# EAGLE design 1-WirePlug (EAGLE 6.5.0)
ABBREV: hb1; PROJECT: Heading Board
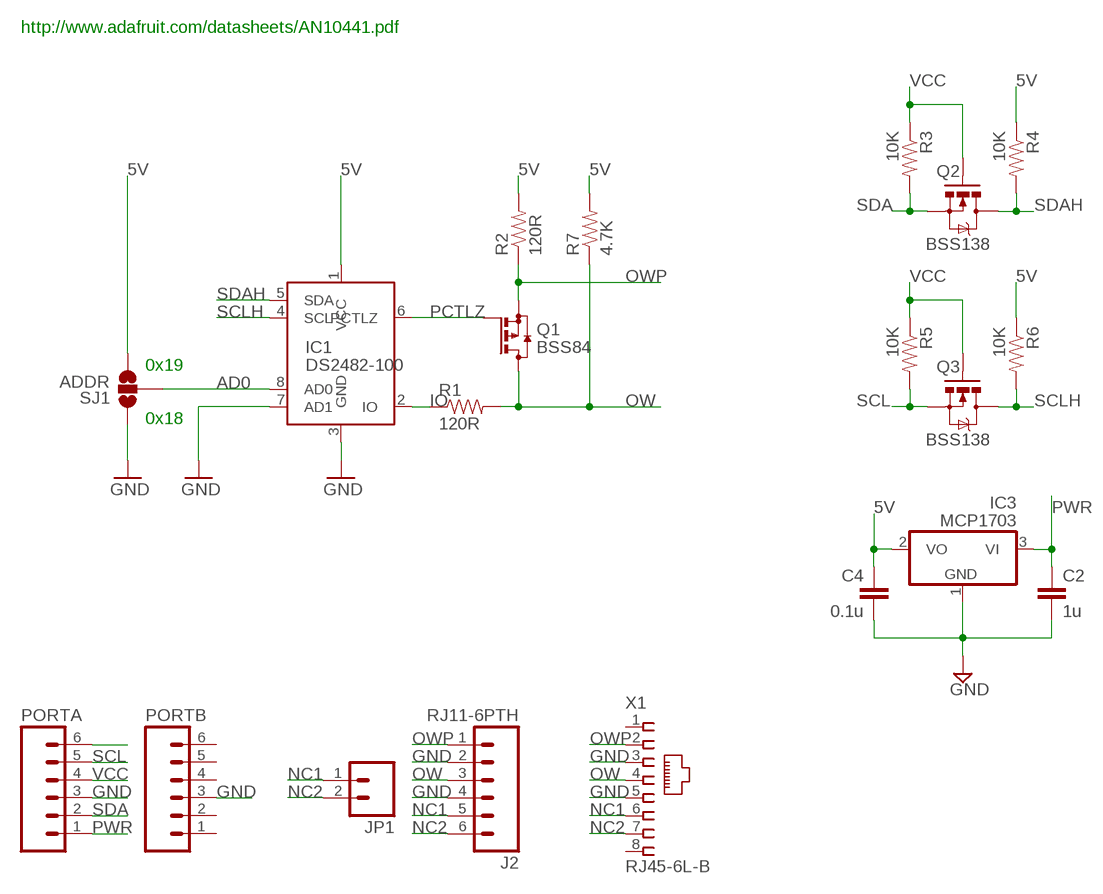
[diagram p0: schematic, sheet 1]

## Parts
C2  1u  CAP0603-CAP  [0603-CAP]
C4  0.1u  CAP0603-CAP  [0603-CAP]
IC1  DS2482-100  [SO08]
IC3  MCP1703  MCP1703CB  [SOT23]
J2  RJ11-6PTH  [RJ11-6]
JP1  M02PTH  [1X02]
PORTA  M06SIP_LOCK  [1X06-SIP_LOCK]
PORTB  M06SIP_LOCK  [1X06-SIP_LOCK]
Q1  BSS84  [SOT23]
Q2  BSS138  MOSFET-NCHANNELSMD  [SOT23-3]
Q3  BSS138  MOSFET-NCHANNELSMD  [SOT23-3]
R1  120R  RESISTOR0603-RES  [0603-RES]
R2  120R  RESISTOR0603-RES  [0603-RES]
R3  10K  RESISTOR0603-RES  [0603-RES]
R4  10K  RESISTOR0603-RES  [0603-RES]
R5  10K  RESISTOR0603-RES  [0603-RES]
R6  10K  RESISTOR0603-RES  [0603-RES]
R7  4.7K  RESISTOR0603-RES  [0603-RES]
SJ1  ADDR  SOLDERJUMPER_2WAYPASTE1&2  [SJ_3_PASTE1&2]
X1  RJ45-6L-B  [RJ45-NO-SHIELD]

## Nets
5V: C4.1 IC1.1(VCC) IC3.2(VO) R2.2 R4.1 R6.1 R7.2 SJ1.3
AD0: IC1.8(AD0) SJ1.2
GND: C2.2 C4.2 IC1.3(GND) IC1.7(AD1) IC3.1(GND) J2.2 J2.4 PORTA.3 PORTB.3 SJ1.1 X1.3 X1.5
IO: IC1.2(IO) R1.1
N$1: PORTA.6
NC1: J2.5 JP1.1 X1.6
NC2: J2.6 JP1.2 X1.7
OW: J2.3 Q1.3(D) R1.2 R7.1 X1.4
OWP: J2.1 Q1.2(S) R2.1 X1.2
PCTLZ: IC1.6(PCTLZ) Q1.1(G)
PWR: C2.1 IC3.3(VI) PORTA.1
SCL: PORTA.5 Q3.2(S) R5.2
SCLH: IC1.4(SCL) Q3.3(D) R6.2
SDA: PORTA.2 Q2.2(S) R3.2
SDAH: IC1.5(SDA) Q2.3(D) R4.2
VCC: PORTA.4 Q2.1(G) Q3.1(G) R3.1 R5.1
Unconnected: PORTB.1 PORTB.2 PORTB.4 PORTB.5 PORTB.6 X1.1 X1.8

## Notes on the sheet
- http://www.adafruit.com/datasheets/AN10441.pdf
- 0x19
- 0x18

## Library data of the parts
C2 C4 = SparkFun:CAP: Capacitor Standard 0603 ceramic capacitor, and 0.1" leaded capacitor.
IC1 = icontroller:DS2482-100: Single-Channel 1-Wire Master
IC3 = linear:MCP1703: 250 mA, 16V, Low Quiescent Current LDO Regulator Source: http://ww1.microchip.com/downloads/en/DeviceDoc/22049b.pdf
J2 = SparkFun:RJ11-6: RJ11 Jack Simple 6 pin RJ11 jack. Commonly found on CAT3 devices and Microchip programmers. SKU: PRT-00132
JP1 = SparkFun:M02: Header 2 Standard 2-pin 0.1" header. Use with straight break away headers (SKU : PRT-00116), right angle break away headers (PRT-00553), swiss pins (PRT-00743), machine pins (PRT-00117), and female headers (PRT-00115). Molex polarized connector foot print use with SKU : PRT-08233 with associated crimp pins and housings.
PORTA PORTB = SparkFun-Connectors:M06: Header 6 Standard 6-pin 0.1" header. Use with straight break away headers (SKU : PRT-00116), right angle break away headers (PRT-00553), swiss pins (PRT-00743), machine pins (PRT-00117), and female headers (PRT-00115). Molex polarized connector foot print use with SKU : PRT-08094 with associated crimp pins and housings. NOTES ON THE VARIANTS LOCK and LOCK_LONGPADS... This footprint was designed to help hold the alignment of a through-hole component (i.e. 6-pin header) while soldering it into place. You may notice that each hole has been shifted either up or down by 0.005 of an inch from it's more standard position (which is a perfectly straight line). This slight alteration caused the pins (the squares in the middle) to touch the edges of the holes. Because they are alternating, it causes a "brace" to hold the component in place. 0.005 has proven to be the perfect amount of "off-center" position when using our standard breakaway headers. Although looks a little odd when you look at the bare footprint, once you have a header in there, the alteration is very hard to notice. Also,if you push a header all the way into place, it is covered up entirely on the bottom side. This idea of altering the position of holes to aid alignment will be further integrated into the Sparkfun Library for other footprints. It can help hold any component with 3 or more connection pins.
Q1 = transistor-small-signal:BSS84: P-CHANNEL MOS FET
Q2 Q3 = SparkFun:MOSFET-NCHANNEL
R1-R7 = SparkFun:RESISTOR: Resistor Basic schematic elements and footprints for 0603, 1206, and PTH resistors.
SJ1 = SparkFun:SOLDERJUMPER_2WAY: Solder Jumper 2 way solder jumper
X1 = con-tycoelectronics:RJ45: CORCOM Modular RJ Jacks No Shield Source: www.tycoelectronics.com .. ENG_DS_1654001_1099_RJ_L_0507.pdf; MPN: RJ45-6L-B; OC_FARNELL: unknown; OC_NEWARK: 16R6090

## Net classes
0 default: width 0.203 mm
1 power: width 0.381 mm, clearance 0.254 mm

## Board
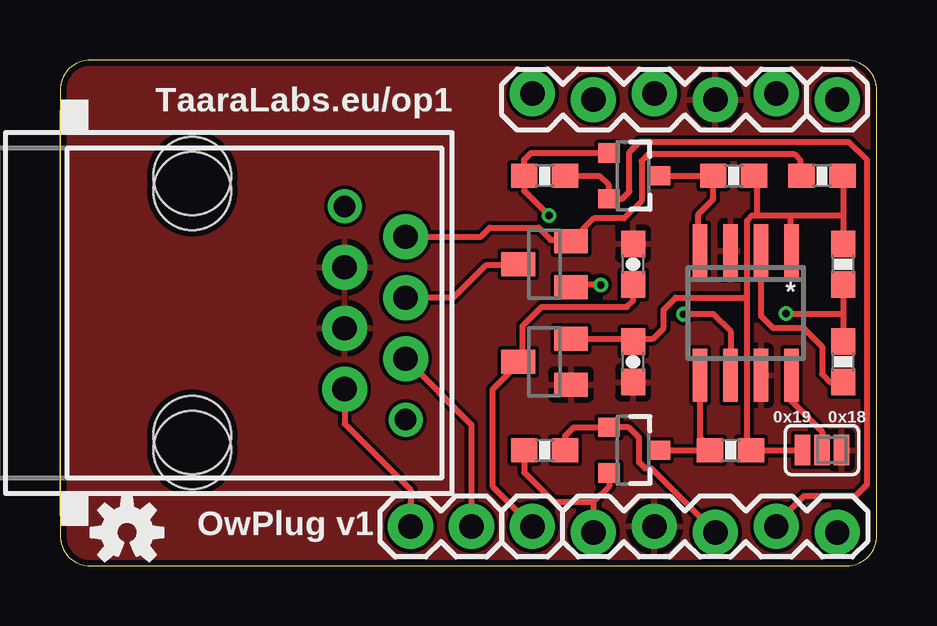
[diagram p1: board, top side]
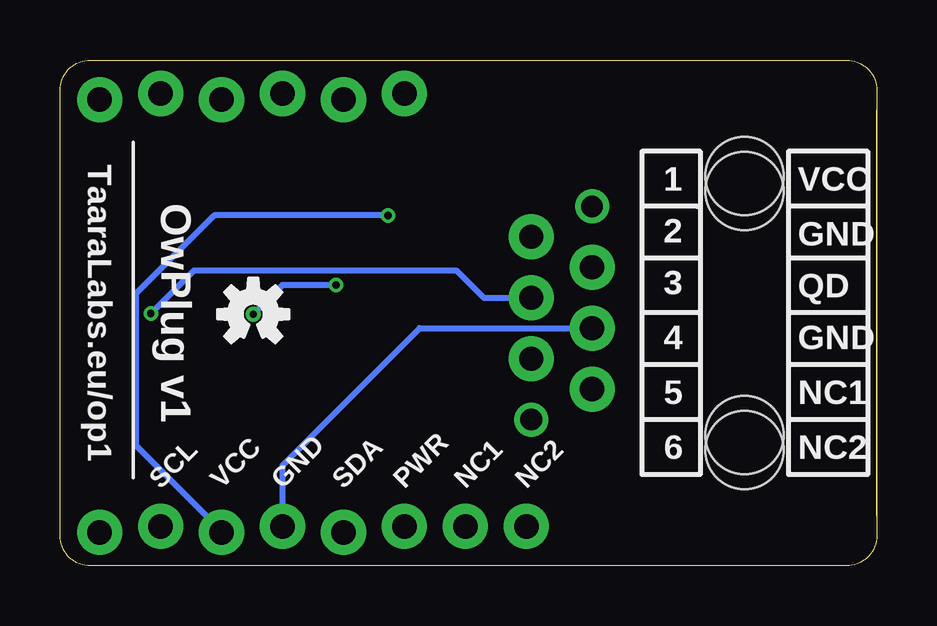
[diagram p2: board, bottom side, seen from below]

Size 34.04 x 21.08 mm. Coordinates in mm from the lower left corner, seen from the top.
Outline: 0,19.81 0,1.27 arc90 1.27,0 32.77,0 arc90 34.04,1.27 34.04,19.81 arc90 32.77,21.08 1.27,21.08 arc90 0,19.81
Copper layers (1*16): Top 0.035mm / dielectric 1.5mm / Bottom 0.035mm
Design rules "ITEADstudio_DRC": minimum track width 6mil, minimum drill 12mil, track to track 6mil, track to pad 6mil, pad to pad 6mil, via to via 6mil, smd to smd 0mil, copper to edge 10mil, drill to drill 10mil, minimum pad ring 10mil, minimum via ring 6mil, stop-mask expansion 2mil, vias tented up to drill 100mil, thermal gap 10mil

### Footprints (pad centres in the part's own frame; a part is rotated, then mirrored left to right if it is on the bottom)
0603-CAP = smd 1.1 x 1: 1 -0.85,0; 2 0.85,0
SO08 = smd 0.6 x 2.2: 1 -1.905,-2.6; 2 -0.635,-2.6; 3 0.635,-2.6; 4 1.905,-2.6; 5 1.905,2.6; 6 0.635,2.6; 7 -0.635,2.6; 8 -1.905,2.6
SOT23 = smd 1 x 1.4: 1 -0.95,-1.1; 2 0.95,-1.1; 3 0,1.1
RJ11-6 = drill 1.016 pad 1.88: 1 1.905,8.89; 2 3.175,6.35; 3 4.445,8.89; 4 5.715,6.35; 5 6.985,8.89; 6 8.255,6.35 | hole 3.251: 0,0; 10.16,0
1X02 = drill 1.016 pad 1.88: 1 0,0; 2 2.54,0
1X06-SIP_LOCK = drill 1.016 pad 1.88: 1 0,0; 2 2.54,-0.254; 3 5.08,0; 4 7.62,-0.254; 5 10.16,0; 6 12.7,-0.254
SOT23-3 = smd 0.8 x 0.9: 1 -0.95,-1; 2 0.95,-1; 3 0,1.1
0603-RES = smd 1.1 x 1: 1 -0.85,0; 2 0.85,0
SJ_3_PASTE1&2 = smd 0.635 x 1.27: 1 -0.813,0; 2 0,0; 3 0.813,0
RJ45-NO-SHIELD = drill 0.9 pad 1.4: 1 -4.445,6.35; 2 -3.175,8.89; 3 -1.905,6.35; 4 -0.635,8.89; 5 0.635,6.35; 6 1.905,8.89; 7 3.175,6.35; 8 4.445,8.89 | hole 3.251: -5.715,0; 5.715,0

### Placement (x,y rotation side)
C2  23.88,12.57 90 top
C4  23.88,8.51 270 top
IC1  28.58,10.54 180 top
IC3  20.19,8.51 90 top
J2  5.51,15.62 270 top
JP1  17.15,1.65 180 top
PORTA  19.69,1.65 0 top
PORTB  32.39,19.43 180 top
Q1  20.19,12.57 90 top
Q2  23.88,4.83 270 top
Q3  23.88,16.26 270 top
R1  32.64,8.51 90 top
R2  31.75,16.26 0 top
R3  20.19,4.83 180 top
R4  27.94,4.83 180 top
R5  20.19,16.26 0 top
R6  28.07,16.26 180 top
R7  32.64,12.57 90 top
SJ1  31.75,4.83 180 top
U$1  [OSHW-LOGO-S]  2.79,1.4 0 top
U$3  [OSHW-LOGO-S]  25.98,10.49 0 bottom
X1  5.51,10.54 270 top

### Tracks (layer width: path | path; a pad name or v marks a point on that pad's centre or on a via)
5V
  Top 0.203: 23.75,9.47 C4.1 23.95,9.47 | 21.31,9.47 IC3.2 | 28.83,4.8 R4.1 28.63,5 | 30.45,13.74 30.45,13.34 IC1.1 | 29.03,16.18 R6.1 | 30.86,4.8 SJ1.3
  Top 0.254: 21.31,9.47 23.75,9.47 | 30.86,4.8 28.83,4.8 | 28.63,5 28.63,11.05 | 28.63,11.05 28.63,14.4 28.83,14.61 29.03,14.61 | 29.03,14.61 30.45,14.61 | 30.45,14.61 32.64,14.61 | 30.45,13.74 30.45,14.61 | 29.03,16.18 29.03,14.61 | 23.95,9.47 24.71,9.47 25.15,9.91 25.15,10.67 25.65,11.18 28.5,11.18 28.63,11.05 | R2.2 32.64,16.26 32.64,14.61 | 32.64,14.61 R7.2
AD0
  Top 0.254: IC1.8 30.48,6.86 31.75,5.59 SJ1.2
GND
  Bottom 0.254: PORTA.3 24.77,4.19 19.05,9.91 X1.5
  pour Top: 0,19.81 0,1.27 arc90 1.27,0 32.77,0 arc90 34.04,1.27 34.04,19.81 arc90 32.77,21.08 1.27,21.08 arc90
IO
  Top 0.203: 29.23,12.52 29.23,13.13 IC1.2
  Top 0.254: IC1.2 29.21,10.41 29.72,9.91 30.99,9.91 31.75,9.14 31.75,8 32.09,7.66 R1.1
NC1
  Top 0.254: X1.6 17.15,5.89 JP1.1
NC2
  Top 0.254: J2.6 11.86,5.92 14.61,3.17 JP1.2
OW  (via drill 0.3)
  Top 0.203: 19.08,12.52 Q1.3
  Top 0.254: 19.08,12.52 17.73,12.52 16.38,11.18 X1.4 | R7.1 32.64,10.52 | 32.64,10.52 R1.2 | v30.25,10.52 32.64,10.52
  Bottom 0.254: v30.25,10.52 28.45,12.32 17.53,12.32 16.38,11.18 X1.4
OWP
  Top 0.203: 30.86,16.18 R2.1 | 21.11,13.54 Q1.2
  Top 0.254: X1.2 17.53,13.72 17.91,14.1 19.94,14.1 20.45,13.59 21.23,13.59 Q1.2 22.25,14.48 23.49,14.48 24.23,15.21 24.23,16.87 24.51,17.14 30.61,17.14 30.86,16.89 30.86,16.18
PCTLZ  (via drill 0.3)
  Top 0.203: 21.31,11.71 Q1.1 | 27.81,8.05 IC1.6
  Top 0.254: v22.53,11.71 21.31,11.71 | v25.98,10.49 27.23,10.49 27.94,9.78 IC1.6
  Bottom 0.254: v22.53,11.71 24.77,11.71 v25.98,10.49
PWR
  Top 0.203: 23.75,11.71 C2.1 | 19.28,8.66 IC3.3 19.08,8.46
  Top 0.254: 19.03,8.37 arc45 IC3.3 19.09,8.43 18.03,7.37 18.03,3.3 PORTA.1 | 19.28,8.66 19.28,10.01 20.07,10.79 23.62,10.79 23.88,11.05 C2.1
SCL
  Top 0.203: 22.94,15.37 Q3.2 22.73,15.37 | 29.84,1.75 PORTA.5
  Top 0.254: 29.84,1.75 31.01,2.92 33.15,2.92 33.63,3.4 33.63,16.92 32.89,17.65 24.13,17.65 23.72,17.25 23.72,15.6 23.43,15.31 Q3.2 | 22.81,15.24 Q3.2 | R5.2 22.48,16.26 22.86,15.88 Q3.2
SCLH
  Top 0.203: 25.17,16.38 Q3.3 | 27.2,16.38 R6.2 | 26.59,13.34 IC1.4
  Top 0.254: 25.17,16.38 25.3,16.26 R6.2 27.22,15.28 26.59,14.66 26.59,13.34
SDA
  Top 0.203: 22.73,3.99 Q2.2
  Top 0.254: 22.85,3.9 Q2.2 22.88,3.32 22.23,2.67 | 22.23,2.67 PORTA.2 | R3.2 19.34,3.9 20.57,2.67 22.23,2.67
SDAH
  Top 0.203: 25.17,4.8 Q2.3 | 27,4.8 R4.2 27,5 | 26.8,7.85 IC1.5
  Top 0.254: 27,4.8 25.17,4.8 | 27,5 26.67,5.33 IC1.5
VCC  (via drill 0.3)
  Top 0.203: 22.73,17.2 Q3.1 | 22.94,5.61 Q2.1 22.73,5.82 22.53,6.02
  Top 0.254: PORTA.4 24.64,4.06 24.38,4.06 24.13,4.32 24.13,5.33 23.69,5.78 Q2.1 21.4,5.78 21.04,5.42 R3.1 | Q3.1 19.62,17.21 19.34,16.93 R5.1 19.34,15.63 v20.37,14.61
  Bottom 0.203: 27.41,1.55 PORTA.4
  Bottom 0.254: 27.41,1.55 30.86,5 30.86,11.35 27.61,14.61 v20.37,14.61

### Text on the board
tNames: TaaraLabs.eu/op1 | * | 0x19 | 0x18 | OwPlug v1
bNames: VCC | 1 | GND | 2 | QD | 3 | OwPlug v1 | TaaraLabs.eu/op1 | GND | 4 | NC1 | 5 | NC2 | 6 | NC2 | NC1 | PWR | SDA | GND | VCC | SCL